# EAGLE design power (EAGLE 8.2.2)
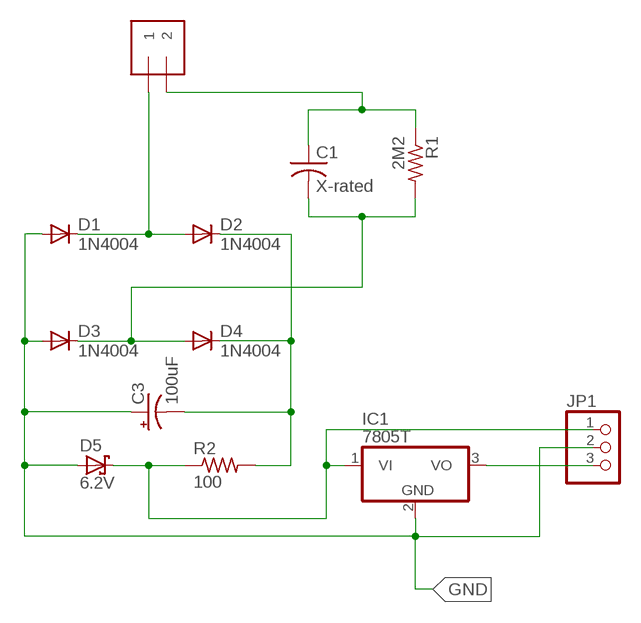
[diagram p0: schematic, sheet 1]

## Parts
C1  X-rated  C-US225-108X268  [C225-108X268]
C3  100uF  CPOL-USE2.5-5  [E2,5-5]
D1  1N4004  [DO41-10]
D2  1N4004  [DO41-10]
D3  1N4004  [DO41-10]
D4  1N4004  [DO41-10]
D5  6.2V  SCHOTTKY-DIODEDO41-7  [DO41-7]
IC1  7805T  [TO220H]
J1  1X2-3.5MM  [1X2-3.5MM]
JP1  PINHD-1X3CB  [1X03-CLEANBIG]
R1  2M2  R-US_0207/10  [0207/10]
R2  100  R-US_0207/10  [0207/10]

## Nets
GND: C3.+ D1.A D3.A D5.A IC1.2(GND) JP1.2
N$2: D1.C D2.A J1.1
N$4: C3.- D2.C D4.C R2.2
N$5: C1.2 D3.C D4.A R1.2
N$6: C1.1 J1.2 R1.1
N$7: D5.C IC1.1(VI) JP1.1 R2.1
N$8: IC1.3(VO) JP1.3

## Library data of the parts
C1 = adafruit:C-US: CAPACITOR, American symbol; OC_NEWARK: unknown
C3 = adafruit:CPOL-US: POLARIZED CAPACITOR, American symbol; MPN: ECA-1EHG101; OC_NEWARK: 96K9155
D1-D4 = adafruit:1N4004: DIODE General purpose 1N400x type rectifier (With bigger pads) http://www.ladyada.net/library/pcb/eaglelibrary.html; MPN: 1N4007RLG; OC_NEWARK: 04X9418
D5 = adafruit:SCHOTTKY-DIODE: Schottky Diode; MF: AMERICAN POWER DEVICES; MPN: 1N823A; OC_NEWARK: 09F4812
IC1 = adafruit:78*: Positive VOLTAGE REGULATOR Added bigger pads to the TO-92 package; MF: FAIRCHILD SEMICONDUCTOR; MPN: KA7805AETU; OC_NEWARK: 09J6572
J1 = adafruit:1X2: 3.5mm Terminal block http://www.ladyada.net/library/pcb/eaglelibrary.html; OC_NEWARK: unknown
JP1 = adafruit:PINHD-1X3: PIN HEADER; OC_NEWARK: unknown
R1 = adafruit:R-US_: RESISTOR, American symbol; MPN: CRCW08052M20JNEA; OC_NEWARK: 59M6869
R2 = adafruit:R-US_: RESISTOR, American symbol; MF: OHMITE; MPN: 25J100E; OC_NEWARK: 64K8263

## Net classes
0 default: width 0.508 mm, drill 30.48 mm, clearance 1.016 mm

## Board
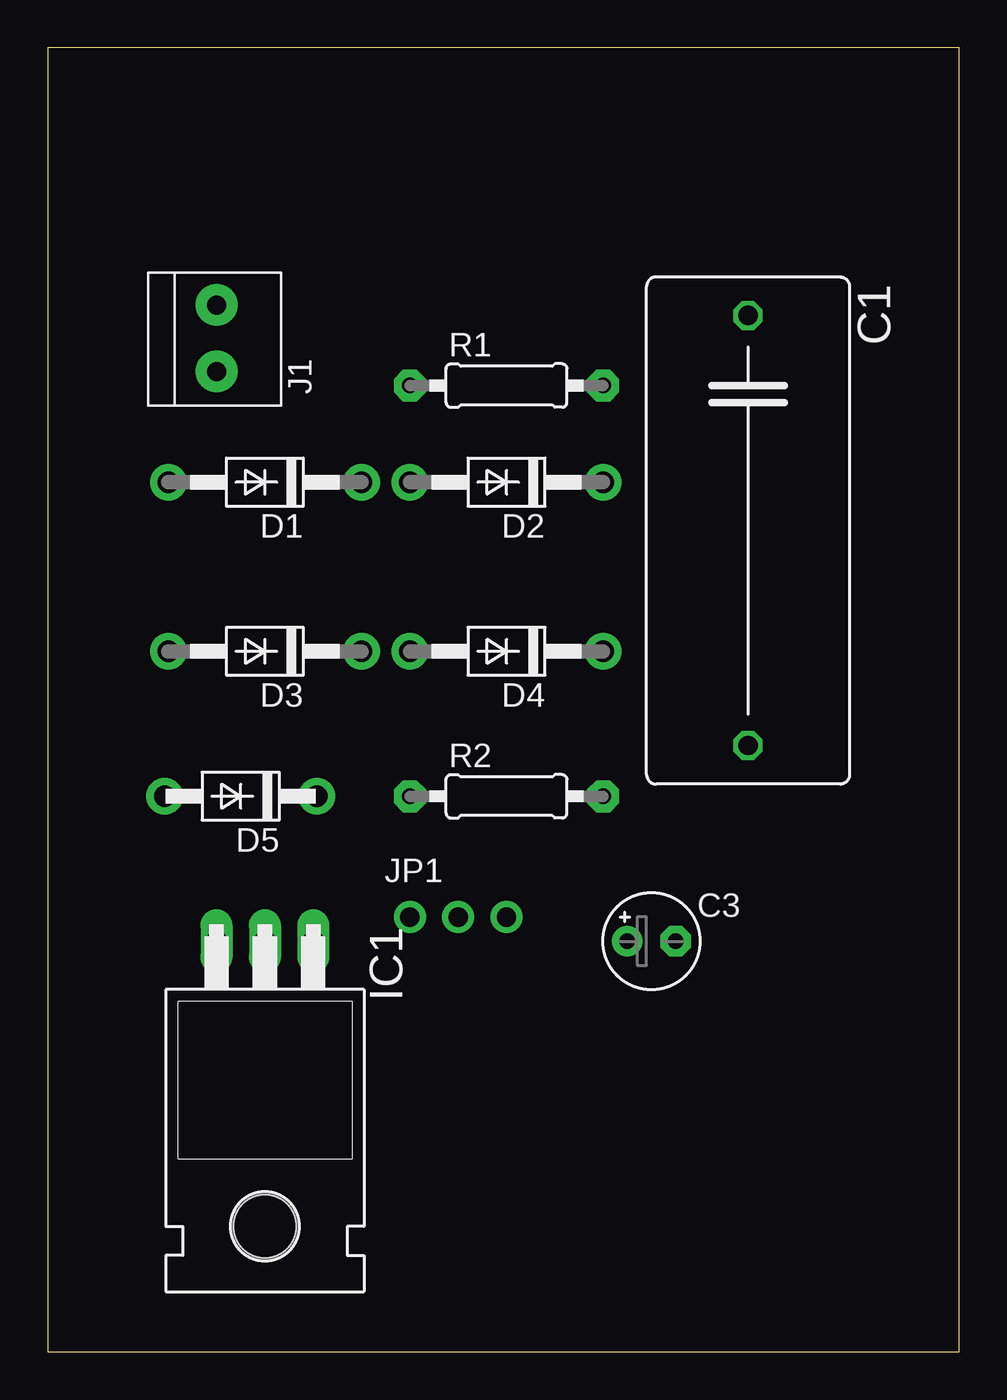
[diagram p1: board, top side]
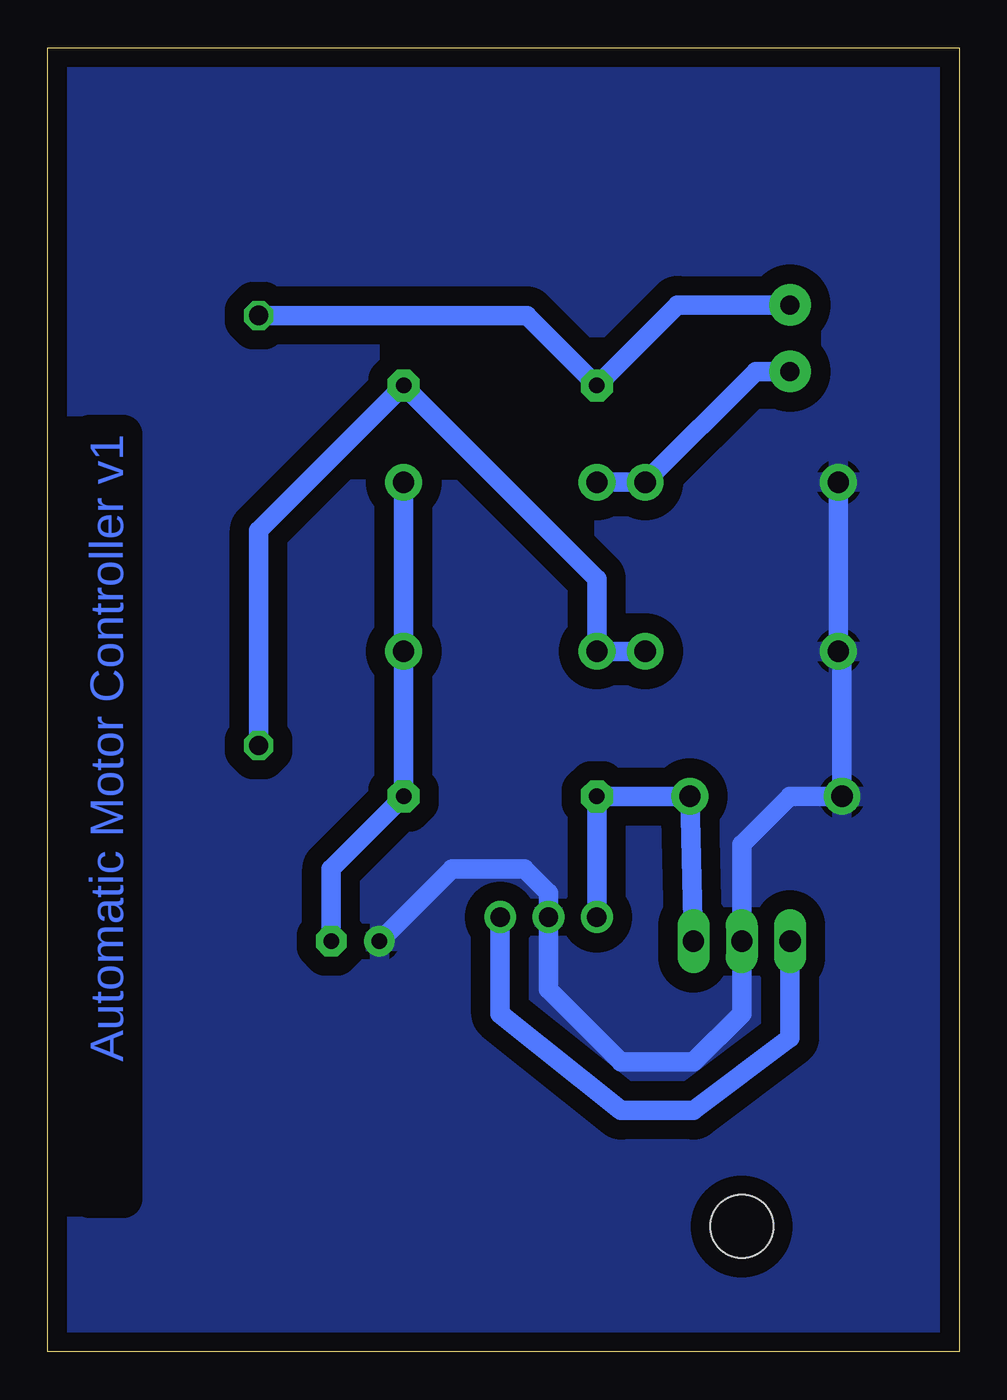
[diagram p2: board, bottom side, seen from below]

Size 47.93 x 68.57 mm. Coordinates in mm from the lower left corner, seen from the top.
Outline: 0,0 47.93,0 47.93,68.57 0,68.57 0,0
Copper layers (1*16): Top 0.035mm / dielectric 1.5mm / Bottom 0.035mm
Design rules "default": minimum track width 6mil, minimum drill 0.35mm, track to track 6mil, track to pad 6mil, pad to pad 6mil, via to via 6mil, smd to smd 6mil, copper to edge 40mil, drill to drill 6mil, minimum pad ring 10mil, minimum via ring 8mil, stop-mask expansion 4mil, vias tented up to drill 0mil, thermal gap 10mil

### Footprints (pad centres in the part's own frame; a part is rotated, then mirrored left to right if it is on the bottom)
C225-108X268 = drill 1.016 octagon: 1 -11.303,0; 2 11.303,0
E2,5-5 = drill 0.813 pad 1.6: + -1.27,0 | drill 0.813 pad 1.6 octagon: - 1.27,0
DO41-10 = drill 1.118 pad 1.93: A 5.08,0; C -5.08,0
DO41-7 = drill 1.118 pad 1.93: A 4,0; C -4,0
TO220H = drill 1.118 long: 1 -2.54,-10.16; 2 0,-10.16; 3 2.54,-10.16 | hole 3.302: 0,4.826
1X2-3.5MM = drill 1 pad 2.184: 1 1.8,0; 2 -1.7,0
1X03-CLEANBIG = drill 1.016 pad 1.676: 1 -2.54,0; 2 0,0; 3 2.54,0
0207/10 = drill 0.813 pad 1.676 octagon: 1 -5.08,0; 2 5.08,0

### Placement (x,y rotation side)
C1  36.83,43.18 270 top
C3  31.75,21.59 0 top
D1  11.43,45.72 180 top
D2  24.13,45.72 180 top
D3  11.43,36.83 180 top
D4  24.13,36.83 180 top
D5  10.16,29.21 180 top
IC1  11.43,11.43 180 top
J1  8.89,53.34 270 top
JP1  21.59,22.86 0 top
R1  24.13,50.8 0 top
R2  24.13,29.21 0 top

### Tracks (layer width: path | path; a pad name or v marks a point on that pad's centre or on a via)
GND
  Bottom 1.016: 6.35,37.41 D3.A | 6.35,37.41 D1.A | 6.35,37.41 6.16,37.22 D5.A 8.89,29.21 11.43,26.67 IC1.2 11.43,17.78 13.97,15.24 17.78,15.24 21.59,19.05 JP1.2 21.59,24.13 22.86,25.4 26.67,25.4 C3.+
  pour Bottom: 0,68.58 0,0 48.26,0 48.26,68.58 1.27,68.58
N$2
  Bottom 1.016: D2.A D1.C 10.69,51.54 J1.1
N$4
  Bottom 1.016: D2.C D4.C R2.2 33.02,25.4 C3.-
N$5
  Bottom 1.016: D3.C D4.A 19.05,40.64 R1.2 36.83,43.18 C1.2
N$6
  Bottom 1.016: J1.2 14.81,55.04 R1.1 22.73,54.48 C1.1
N$7
  Bottom 1.016: IC1.1 D5.C R2.1 JP1.1
N$8
  Bottom 1.016: IC1.3 8.89,16.51 13.97,12.7 17.78,12.7 24.13,17.78 JP1.3

### Text on the board
Bottom: Automatic Motor Controller v1